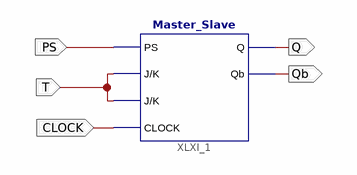
[diagram p0: schematic sheet 1]
// Xilinx ISE schematic T_FF.sch (artix7) as structural Verilog: 1 symbols, 5 ports
module T_FF (
  input  T,
  input  PS,
  input  CLOCK,
  output Q,
  output Qb
);

  Master_Slave XLXI_1 (.CLOCK(CLOCK), .J(T), .K(T), .PS(PS), .Q(Q), .Qb(Qb));
endmodule
